# EasyEDA schematic ATTiny85 Programming Shield_2020-06-15_16-40-15.json
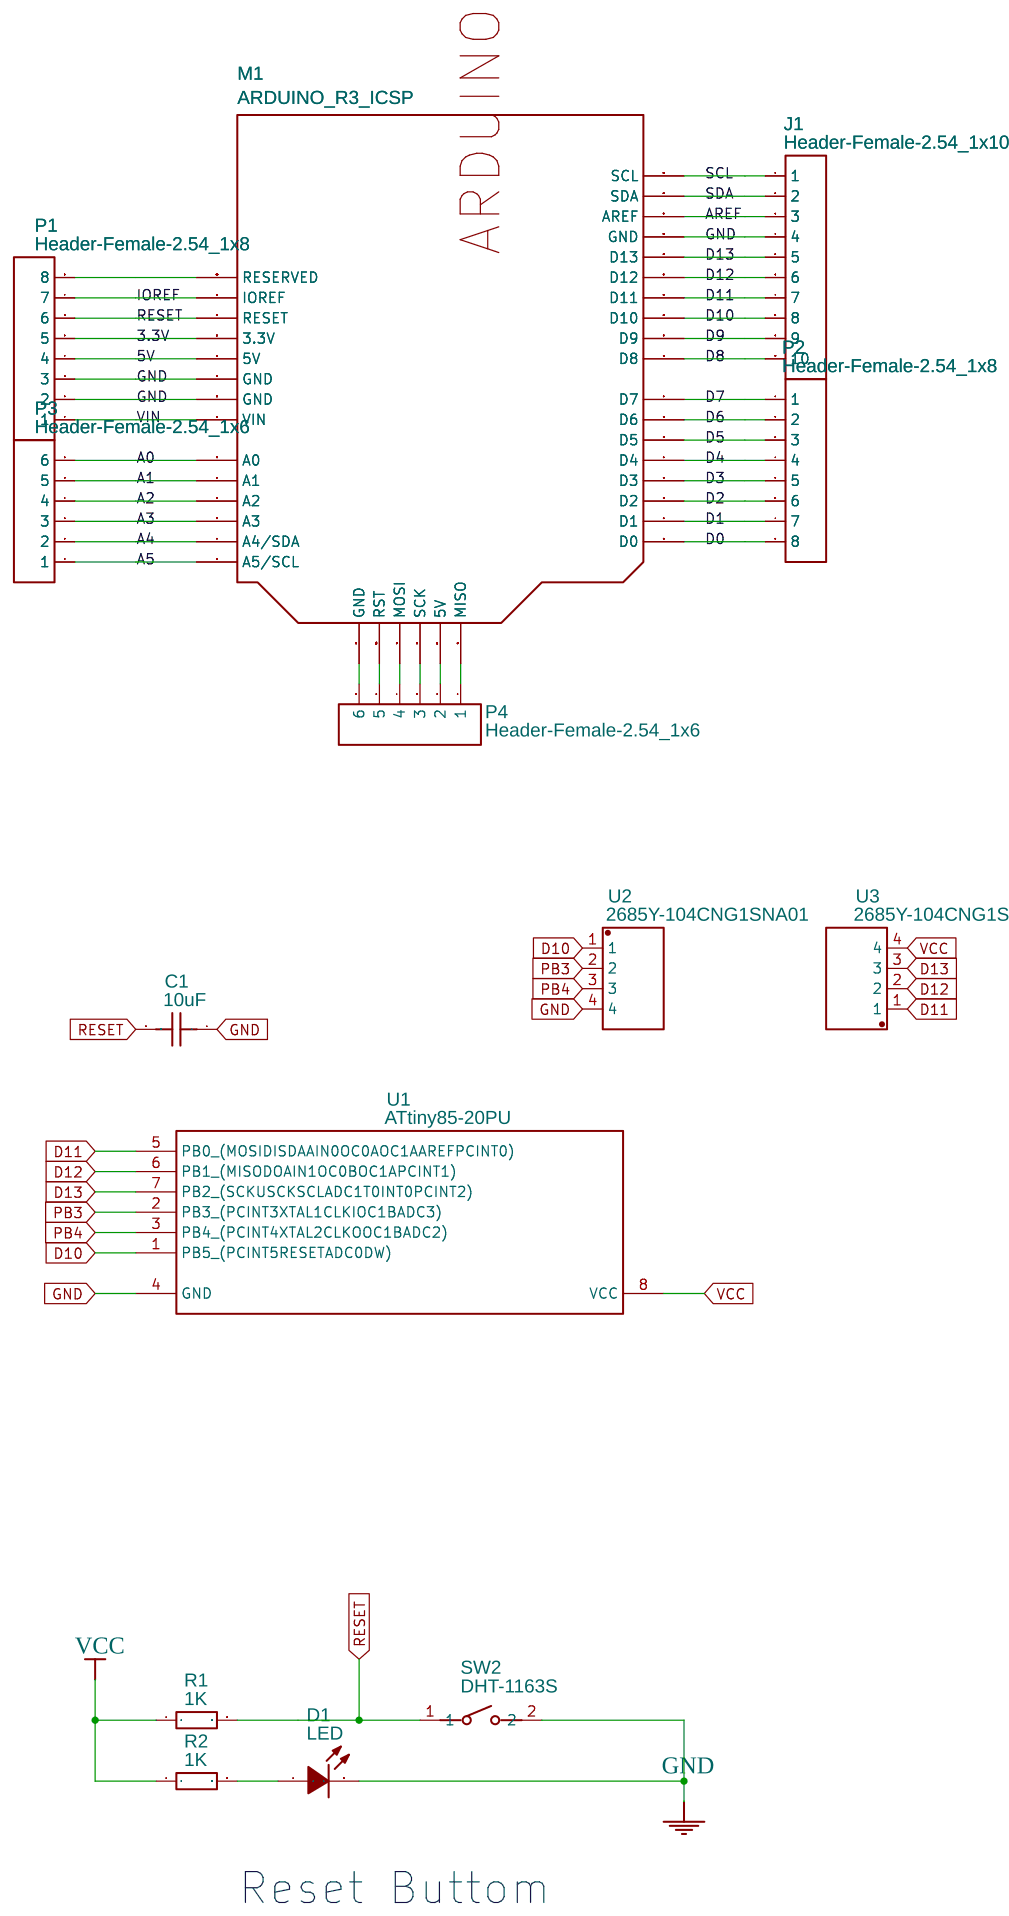
[diagram p0: schematic sheet]

## Parts
C1  10uF  [C0805]
D1  LED  [LED-0603]
J1  Header-Female-2.54_1x10  [HDR-TH_10PIN-V-FEMALE-PITCH2.54]
M1  ARDUINO_R3_ICSP  [ARDUINOR3_ICSP]
P1  Header-Female-2.54_1x8  [HDR-8X1/2.54]
P2  Header-Female-2.54_1x8  [HDR-8X1/2.54]
P3  Header-Female-2.54_1x6  [HDR-6X1/2.54]
P4  Header-Female-2.54_1x6  [HDR-6X1/2.54]
R1  1K  [R0805]
R2  1K  [R0805]
SW2  DHT-1163S  [SW2-4.0-6.0X3.0X2.5MM]
U1  ATtiny85-20PU  [DIP8]
U2  2685Y-104CNG1SNA01  [2685Y-104CNG1SNA01]
U3  2685Y-104CNG1SNA01  [2685Y-104CNG1SNA01]

## Library data of the parts
C1 = CL21A106KPFNNNG: Supplier: LCSC; Supplier Part: C307523; Manufacturer: Samsung Electro-Mechanics; Contributor: LCSC; LCSC Assembly: Yes; SMT Type: Extend
D1 = LED: Manufacturer Part: ?
J1 = -: Supplier: LCSC; Manufacturer: BOOMELE; Manufacturer Part: 2.54mm 1*10P Straight Female header Gold-plated; Supplier Part: C35445
M1 = -: catid: 20; sourceId: qGgecxTfB; Manufacturer Part: ?
P1 P2 = -: Supplier: LCSC; Manufacturer: BOOMELE; Manufacturer Part: Female headerHDR1X8-2.54; Supplier Part: C27438
P3 P4 = -: Supplier: LCSC; Manufacturer: BOOMELE; Manufacturer Part: Female header 1*6p; Supplier Part: C40877
R1 R2 = TC0525F1001T5E: Supplier: LCSC; Manufacturer: UniOhm; Supplier Part: C75781; LCSC Assembly: Yes; SMT Type: Extend
SW2 = -: SMD Button Top;12V; catid: 20; sourceId: xl1xPJpjB
U1 = -: 8-bit AVR Microcontroller, 20MHz, 2.7-5.5V, 8K Flash, 512 Bytes EEPROM, 512 Bytes SRAM, Industrial Grade (-40u7648 to 85u7648), 8-Lead PDIP, Pb-Free
U2 U3 = -: Supplier: LCSC; Supplier Part: C350310; Manufacturer: 华宇创; Contributor: LCSC

## Nets
3.3V: M1.3.3V P1.5
5V: M1.5V P1.4
GND: C1.1 D1.2(K) J1.4 M1.GND P1.2 P1.3 P4.6 SW2.2 U1.4(GND) U2.4
VCC: R1.1 R2.1 U1.8(VCC) U3.4
VIN: M1.VIN P1.1
A0: M1.A0 P3.6
A1: M1.A1 P3.5
A2: M1.A2 P3.4
A3: M1.A3 P3.3
A4: M1.A4(A4/SDA) P3.2
A5: M1.A5(A5/SCL) P3.1
AREF: J1.3 M1.AREF
D0: M1.D0 P2.8
D1: M1.D1 P2.7
D2: M1.D2 P2.6
D3: M1.D3 P2.5
D4: M1.D4 P2.4
D5: M1.D5 P2.3
D6: M1.D6 P2.2
D7: M1.D7 P2.1
D8: J1.10 M1.D8
D9: J1.9 M1.D9
D10: J1.8 M1.D10 U1.1(PB5 (PCINT5RESETADC0DW)) U2.1
D11: J1.7 M1.D11 U1.5(PB0 (MOSIDISDAAIN0OC0AOC1AAREFPCINT0)) U3.1
D12: J1.6 M1.D12 U1.6(PB1 (MISODOAIN1OC0BOC1APCINT1)) U3.2
D13: J1.5 M1.D13 U1.7(PB2 (SCKUSCKSCLADC1T0INT0PCINT2)) U3.3
IOREF: M1.IOREF P1.7
PB3: U1.2(PB3 (PCINT3XTAL1CLKIOC1BADC3)) U2.2
PB4: U1.3(PB4 (PCINT4XTAL2CLKOOC1BADC2)) U2.3
RESET: C1.2 M1.RESET P1.6 R1.2 SW2.1
SCL: J1.1 M1.SCL
SDA: J1.2 M1.SDA
Net-(D1-1): D1.1(A) R2.2
Net-(M1-5V_ICSP): M1.5V_ICSP(5V) P4.2
Net-(M1-MISO): M1.MISO P4.1
Net-(M1-MOSI): M1.MOSI P4.4
Net-(M1-RESERVED): M1.RESERVED P1.8
Net-(M1-RESET_ICSP): M1.RESET_ICSP(RST) P4.5
Net-(M1-SCK): M1.SCK P4.3

## Notes on the sheet
- Reset Buttom
